# EAGLE schematic #6 v1 (EAGLE 9.7.0)
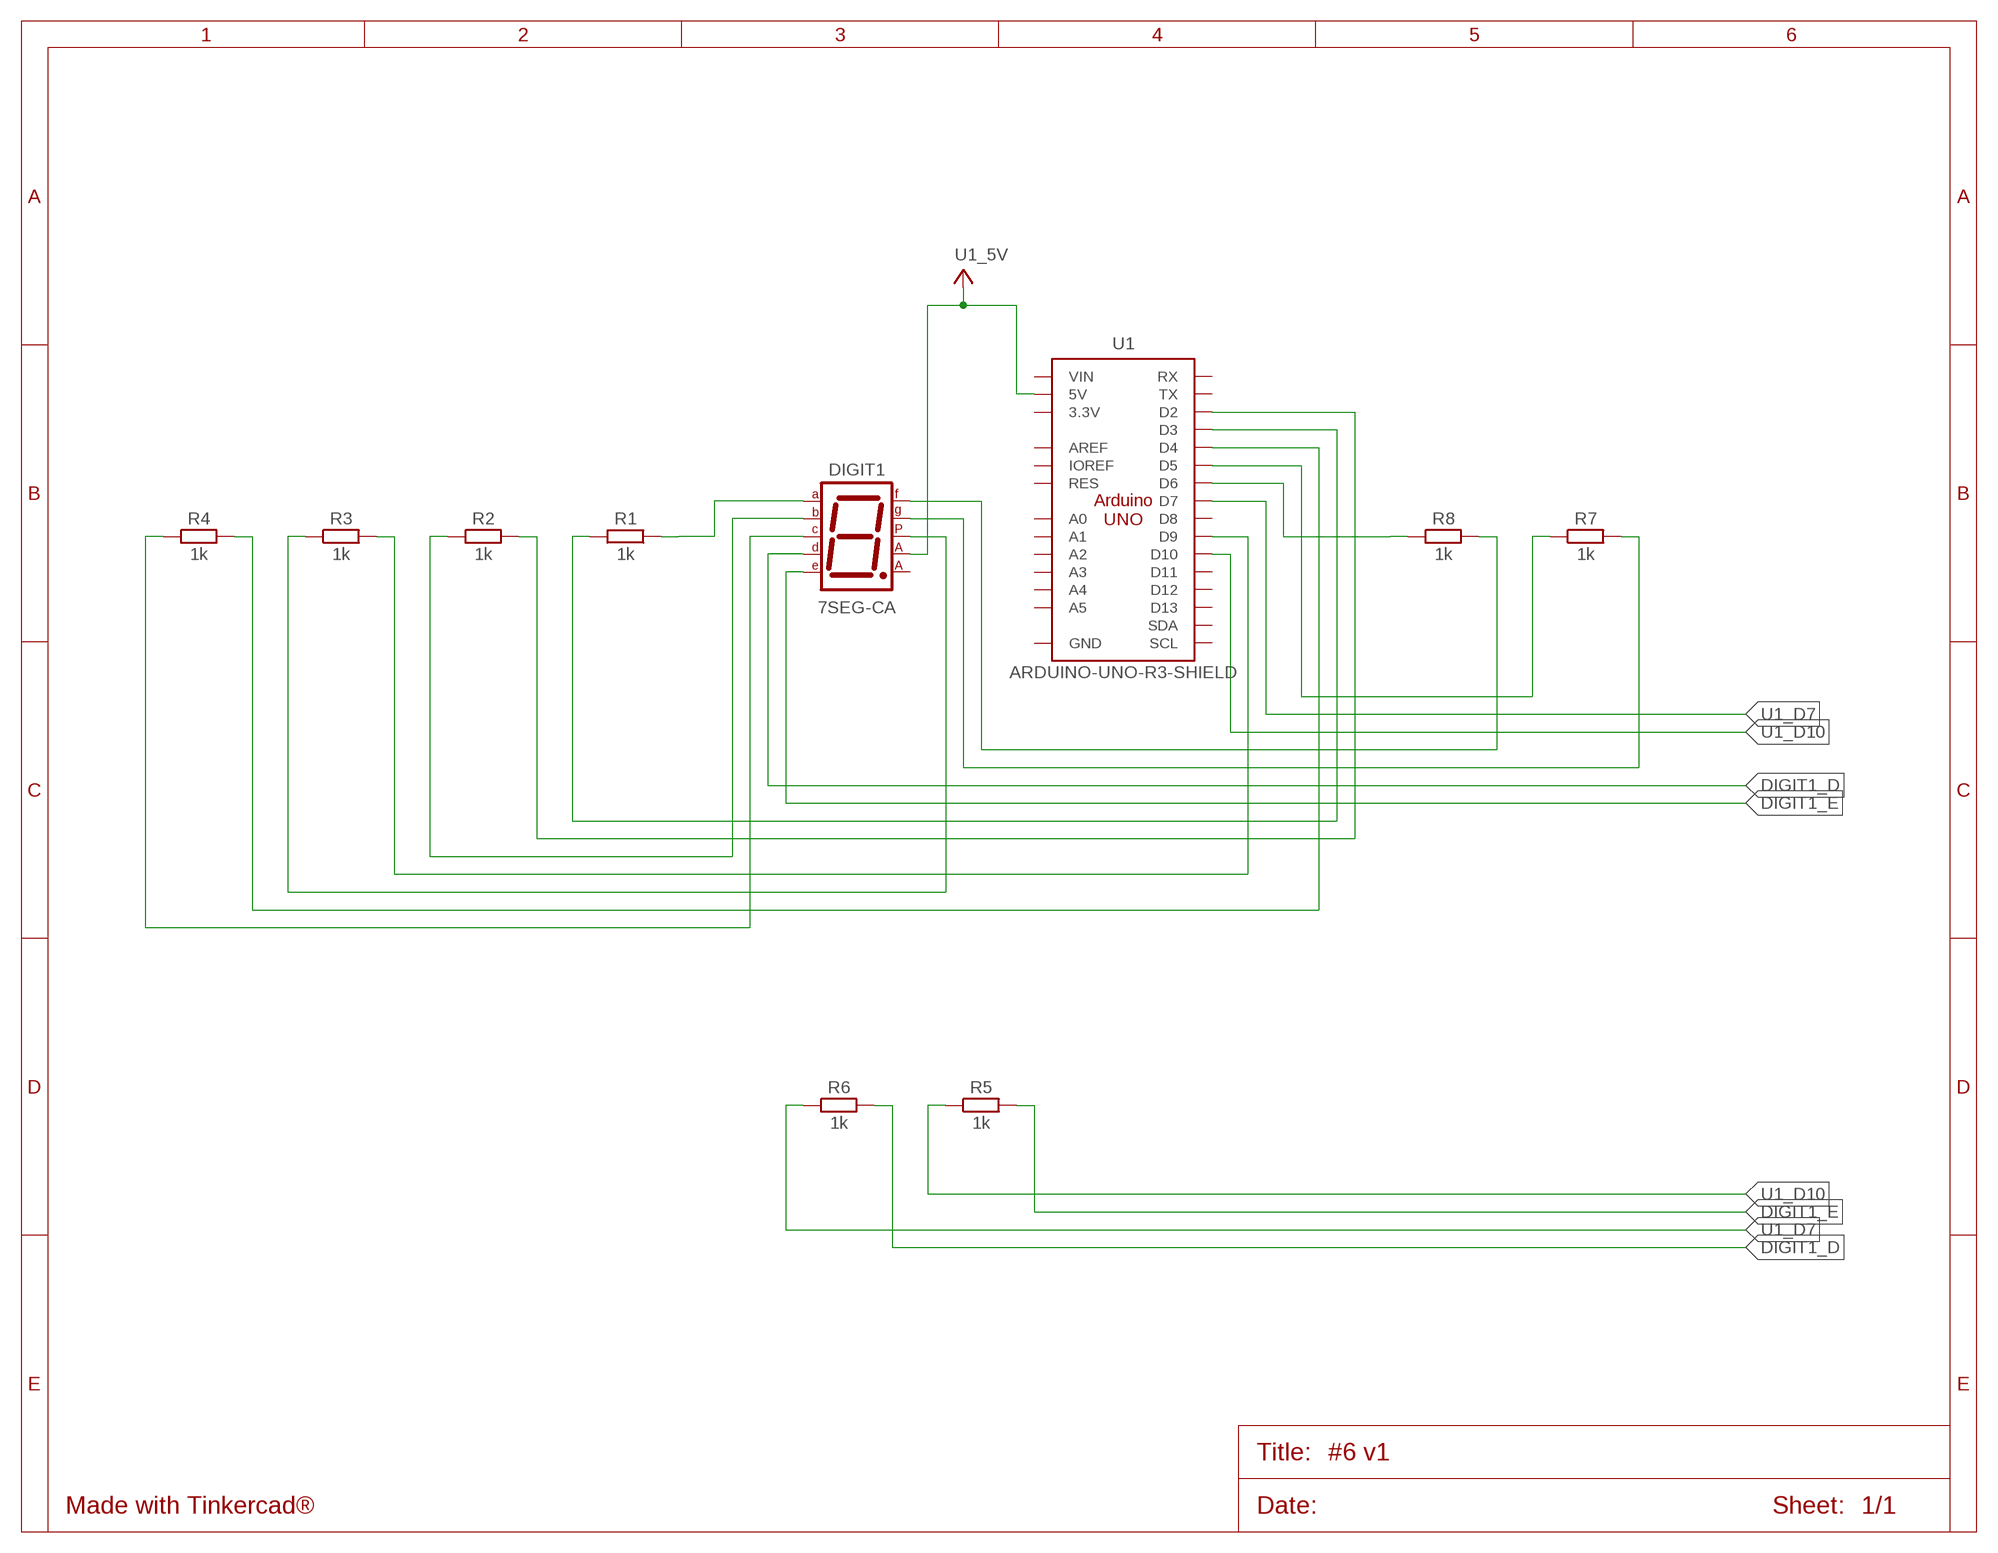
[diagram p0: schematic, sheet 1]

## Parts
DIGIT1  7SEG-CA  [7SEG-13]
R1  1k  RESISTOR_AXIAL-10.16MM-PITCH  [RESAD1016W63L850D250B]
R2  1k  RESISTOR_AXIAL-10.16MM-PITCH  [RESAD1016W63L850D250B]
R3  1k  RESISTOR_AXIAL-10.16MM-PITCH  [RESAD1016W63L850D250B]
R4  1k  RESISTOR_AXIAL-10.16MM-PITCH  [RESAD1016W63L850D250B]
R5  1k  RESISTOR_AXIAL-10.16MM-PITCH  [RESAD1016W63L850D250B]
R6  1k  RESISTOR_AXIAL-10.16MM-PITCH  [RESAD1016W63L850D250B]
R7  1k  RESISTOR_AXIAL-10.16MM-PITCH  [RESAD1016W63L850D250B]
R8  1k  RESISTOR_AXIAL-10.16MM-PITCH  [RESAD1016W63L850D250B]
U1  ARDUINO-UNO-R3-SHIELD  [ARDUINO-UNO-R3-SHIELD]

## Nets
DIGIT1_A: DIGIT1.7(A) R1.1
DIGIT1_B: DIGIT1.6(B) R2.1
DIGIT1_C: DIGIT1.4(C) R4.1
DIGIT1_D: DIGIT1.2(D) R6.2
DIGIT1_DP: DIGIT1.5(DP) R3.1
DIGIT1_E: DIGIT1.1(E) R5.2
DIGIT1_F: DIGIT1.9(F) R8.2
DIGIT1_G: DIGIT1.10(G) R7.2
U1_5V: DIGIT1.3(CA1) U1.5V
U1_D2: R2.2 U1.D2
U1_D3: R1.2 U1.D3
U1_D4: R4.2 U1.D4
U1_D5: R7.1 U1.D5
U1_D6: R8.1 U1.D6
U1_D7: R6.1 U1.D7
U1_D9: R3.2 U1.D9
U1_D10: R5.1 U1.D10
Unconnected: DIGIT1.8(CA2) U1.3.3V U1.A0 U1.A1 U1.A2 U1.A3 U1.A4 U1.A5 U1.AREF U1.D8 U1.D11 U1.D12 U1.D13 U1.GND@0(GND) U1.GND@1(GND) U1.GND@2(GND) U1.IOREF U1.RES U1.RX U1.SCL U1.SDA U1.TX U1.VIN

## Library data of the parts
DIGIT1 = Tinkercad:7SEG-CA: 7-segment DISPLAY single anode, 13 mm; CATEGORY: Opto-Electronic; SUB-CATEGORY: Display; TYPE: 7-Segment
R1-R8 = Tinkercad:RESISTOR: Resistor Fixed - Generic
U1 = Tinkercad:ARDUINO-UNO-R3-SHIELD